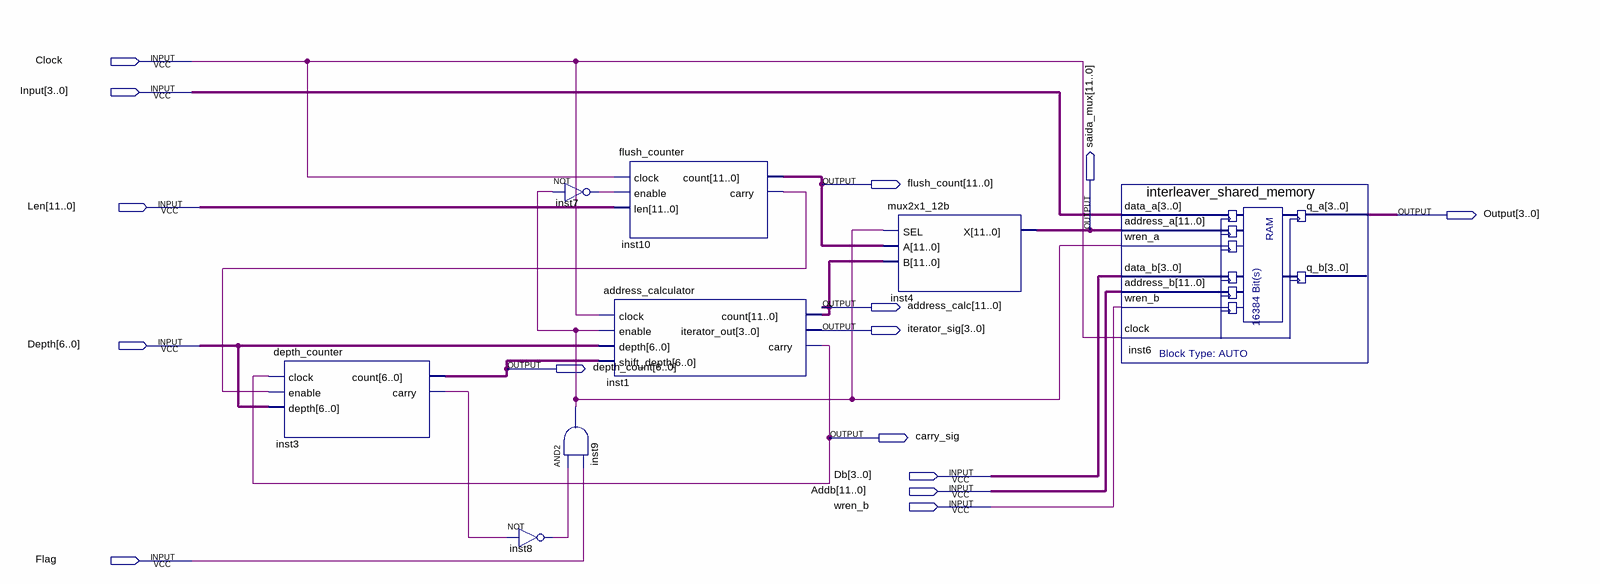
[diagram p0: schematic sheet]
// Quartus schematic interleaver_rev2.bdf as structural Verilog: 8 symbols, 15 pins
module interleaver_rev2 (
  input  Clock,
  input  [3:0] Input,
  input  [11:0] Len,
  input  [6:0] Depth,
  input  [3:0] Db,
  input  [11:0] Addb,
  input  wren_b,
  input  Flag,
  output [11:0] flush_count,
  output [3:0] Output,
  output [11:0] saida_mux,
  output [11:0] address_calc,
  output [3:0] iterator_sig,
  output [6:0] depth_count,
  output carry_sig
);

  wire inst3_carry, inst7_out, inst8_out, inst9_out, inst10_carry;

  depth_counter inst3 (
    .clock(carry_sig), .enable(inst10_carry), .depth(Depth), .count(depth_count), .carry(inst3_carry));
  not inst8 (inst8_out, inst3_carry);
  not inst7 (inst7_out, inst9_out);
  and inst9 (inst9_out, inst8_out, Flag);
  flush_counter inst10 (.clock(Clock), .enable(inst7_out), .len(Len), .count(flush_count), .carry(inst10_carry));
  address_calculator inst1 (
    .clock(Clock), .enable(inst9_out), .depth(Depth), .shift_depth(depth_count), .count(address_calc),
    .iterator_out(iterator_sig), .carry(carry_sig));
  mux2x1_12b inst4 (.SEL(inst9_out), .A(flush_count), .B(address_calc), .X(saida_mux));
  interleaver_shared_memory inst6 (
    .data_a(Input), .address_a(saida_mux), .wren_a(inst9_out), .data_b(Db), .address_b(Addb),
    .wren_b(wren_b), .clock(Clock), .q_a(Output));  // open: q_b
endmodule
